# EAGLE design uBristleBot-Pogo-Programmer (EAGLE 7.3.0)
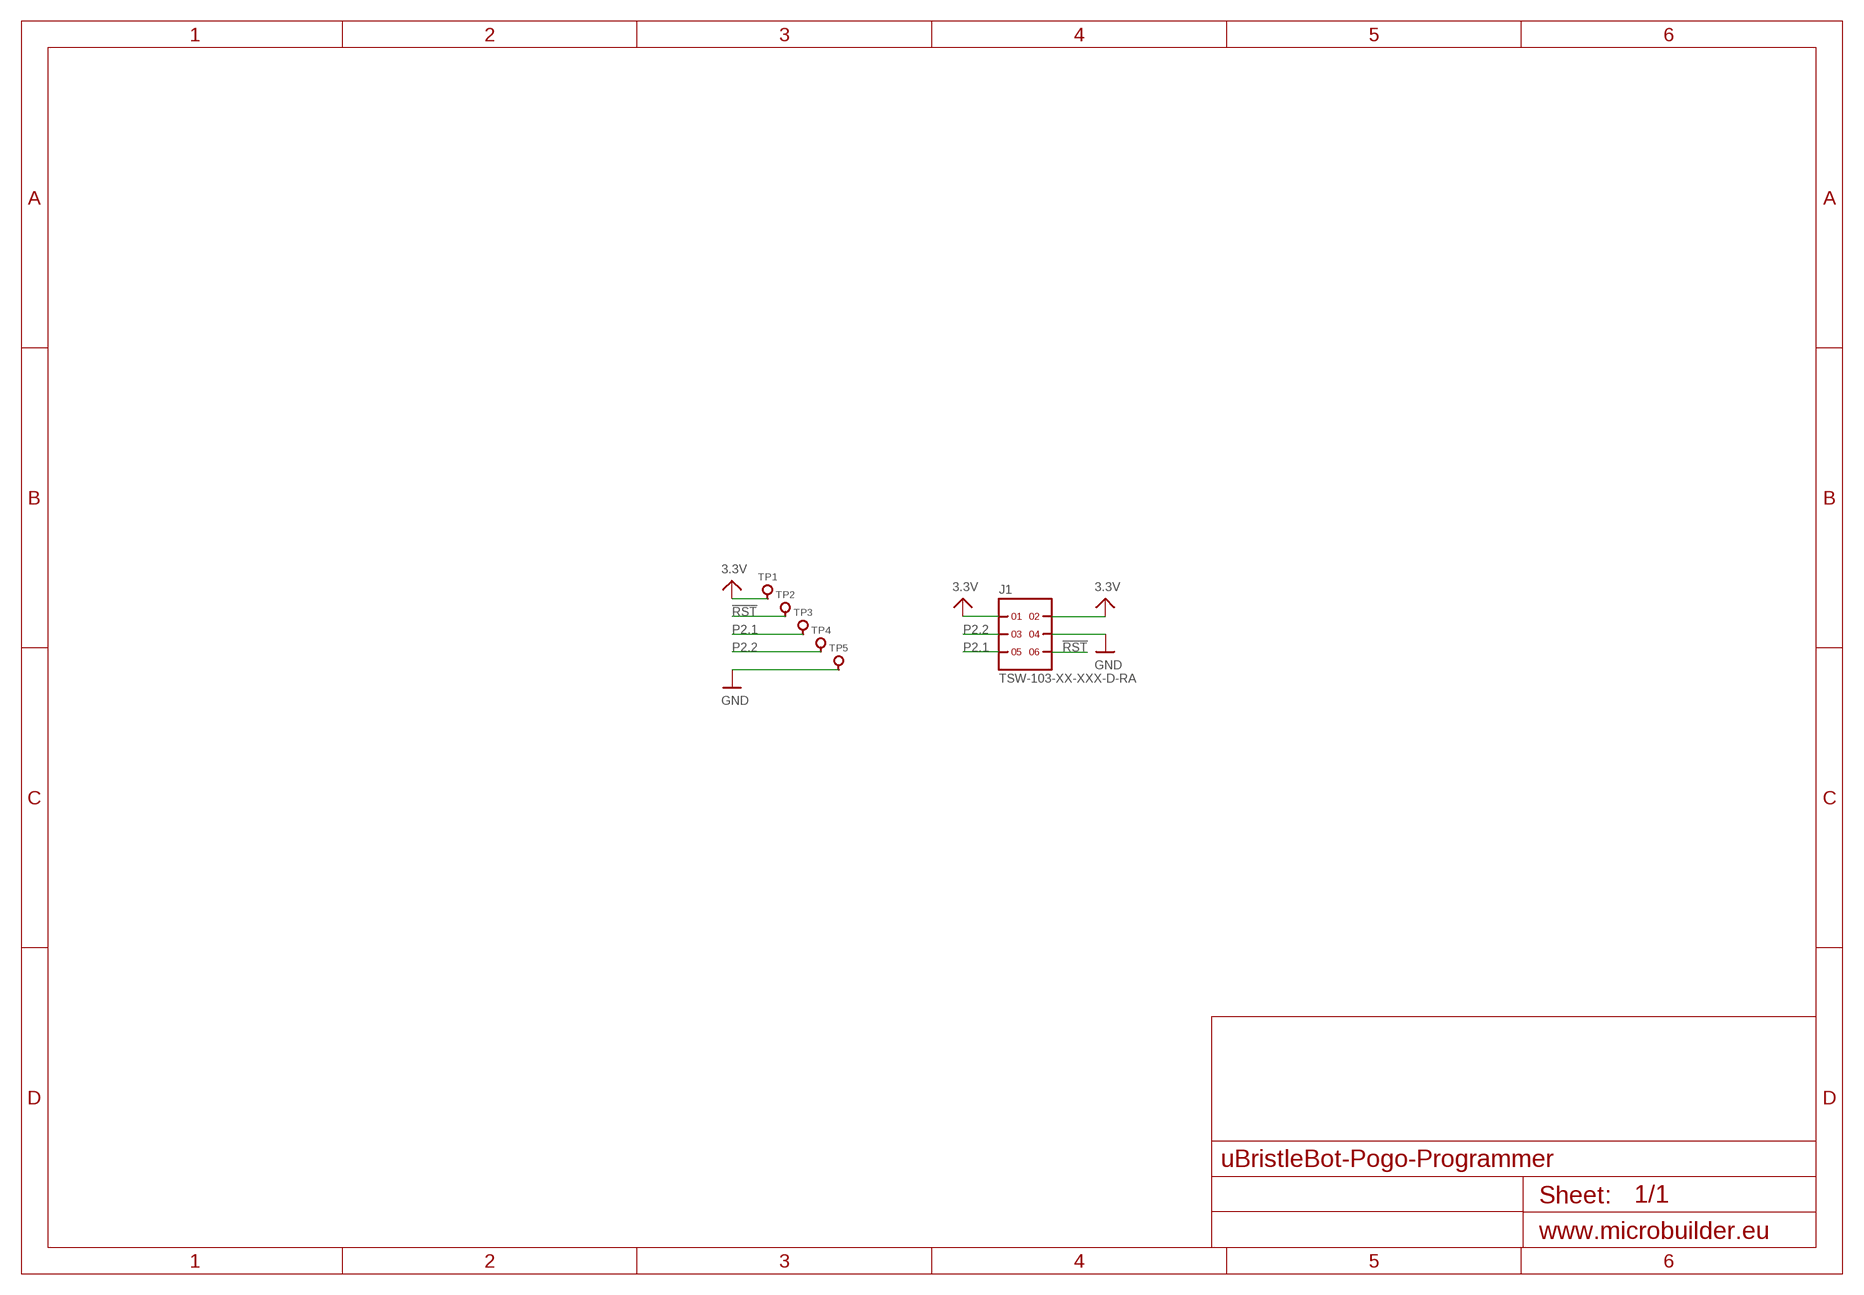
[diagram p0: schematic, sheet 1]

## Parts
J1  TSW-103-XX-XXX-D-RA  [TSW-103-XX-XXX-D-RA]
TP1  0906-0  [0906-0]
TP2  0906-0  [0906-0]
TP3  0906-0  [0906-0]
TP4  0906-0  [0906-0]
TP5  0906-0  [0906-0]

## Nets
3.3V: J1.1 J1.2 TP1.P$1(PIN)
!RST: J1.6 TP2.P$1(PIN)
GND: J1.4 TP5.P$1(PIN)
P2.1: J1.5 TP3.P$1(PIN)
P2.2: J1.3 TP4.P$1(PIN)

## Library data of the parts
J1 = samtec:TSW-103-XX-XXX-D-RA
TP1-TP5 = mill_max:0906-0

## Board
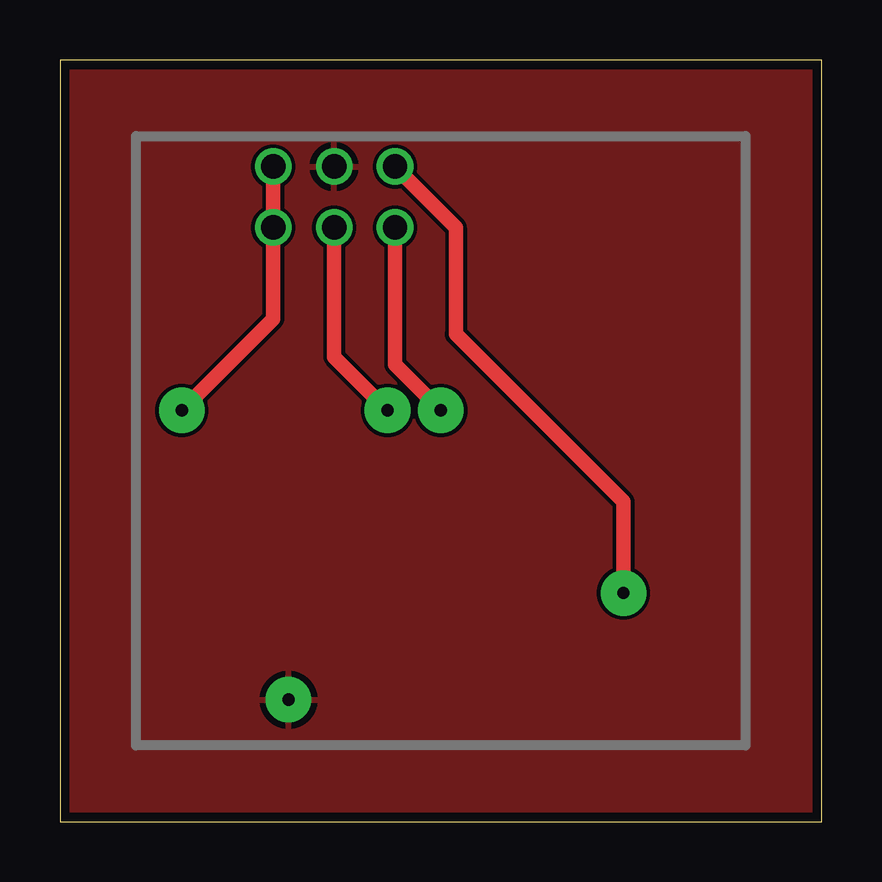
[diagram p1: board, top side]
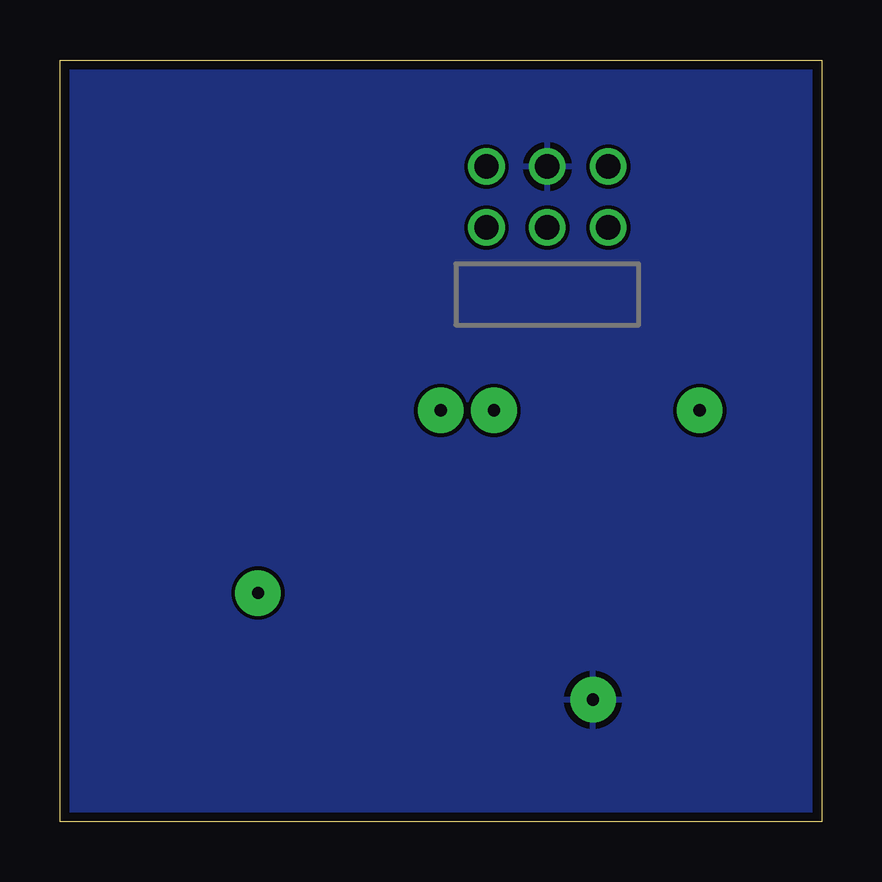
[diagram p2: board, bottom side, seen from below]

Size 31.75 x 31.75 mm. Coordinates in mm from the lower left corner, seen from the top.
Outline: 0,0 31.75,0 31.75,31.75 0,31.74 0,0
Copper layers (1*16): Top 0.0356mm / dielectric 1.5011mm / Bottom 0.0356mm
Design rules "OSHPark": minimum track width 6mil, minimum drill 13mil, track to track 6mil, track to pad 6mil, pad to pad 6mil, via to via 6mil, smd to smd 6mil, copper to edge 15mil, drill to drill 6mil, minimum pad ring 7mil, minimum via ring 7mil, stop-mask expansion 4mil, vias tented up to drill 16mil, thermal gap 10mil

### Footprints (pad centres in the part's own frame; a part is rotated, then mirrored left to right if it is on the bottom)
TSW-103-XX-XXX-D-RA = drill 1.016 pad 1.524: 1 -2.54,1.27; 2 -2.54,-1.27; 3 0,1.27; 4 0,-1.27; 5 2.54,1.27; 6 2.54,-1.27
0906-0 = drill 0.508 pad 1.905: P$1 0,0

### Placement (x,y rotation side)
J1  11.43,26.04 180 bottom
TP1  5.08,17.14 180 top
TP2  23.5,9.53 180 top
TP3  15.88,17.14 180 top
TP4  13.65,17.14 180 top
TP5  9.53,5.08 180 top

### Tracks (layer width: path | path; a pad name or v marks a point on that pad's centre or on a via)
3.3V
  Top 0.61: J1.2 J1.1 8.89,20.95 TP1.P$1
!RST
  Top 0.61: J1.6 16.51,24.77 16.51,20.32 23.5,13.34 TP2.P$1
GND
  pour Bottom (rank 6): 0,0 31.75,0 31.75,31.75 0,31.75
  pour Top (rank 6): 0,31.75 31.75,31.75 31.75,0 0,0
P2.1
  Top 0.61: J1.5 13.97,19.05 TP3.P$1
P2.2
  Top 0.61: J1.3 11.43,19.37 TP4.P$1

### Text on the board
tDocu: For v0.2 | uBristleBot Pgmr | 40 | Cruz Monrreal II | TheNextPlateau.com